# Altium project Smart_Door.PrjPcb (part 2 of 2)

## Sheet [06]-POWER_SUPPLY.SchDoc
size A4; Organization: Indruino Co., Ltd; Address1: No. 1, Vo Van Ngan Street; Address2: Thu Duc District, HCMC; SheetNumber: 7; SheetTotal: 9
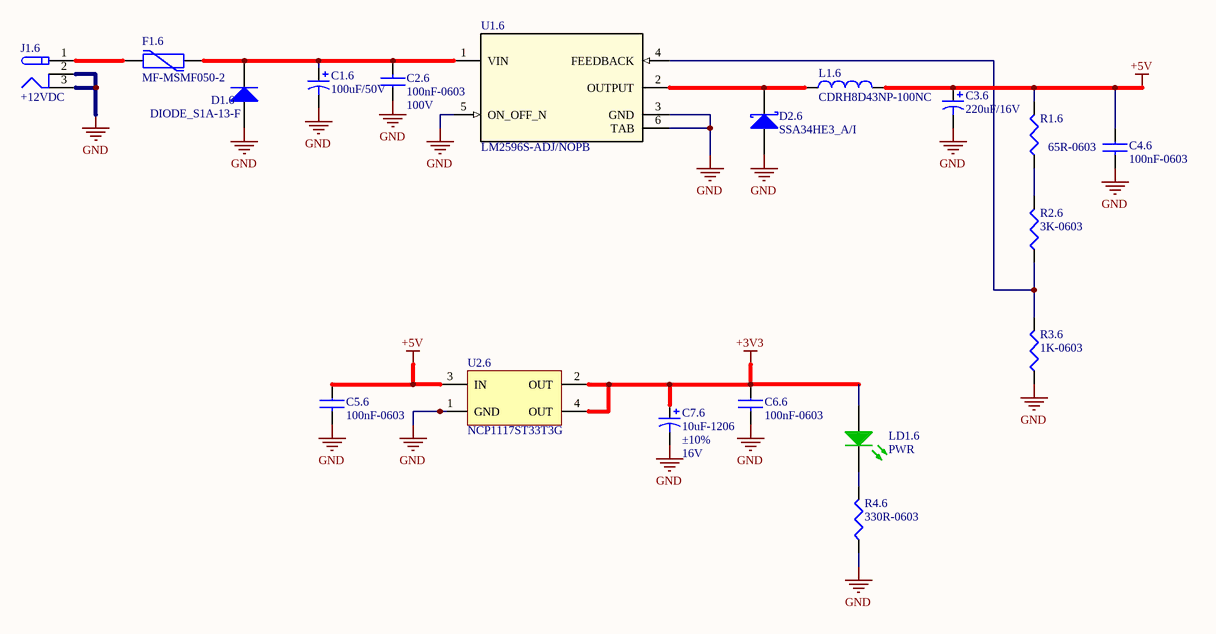
[diagram p4: [06]-POWER_SUPPLY.SchDoc]

### Parts
C1.6  value 100uF/50V  [CAPPR5-10x16]  (hidden comment: Cap Polar)
C2.6  100nF-0603  Voltage - Rated: 100V  [CAP0603]
C3.6  value 220uF/16V  [CAPPR5-10x16]  (hidden comment: Cap Polar)
C4.6  100nF-0603  [CAP0603]
C5.6  100nF-0603  [CAP0603]
C6.6  100nF-0603  [CAP0603]
C7.6  10uF-1206  Tolerance: ±10%  Voltage - Rated: 16V  [CAP1206_TANTALUM_YELLOW]
D1.6  DIODE_S1A-13-F  [DO-214AC]
D2.6  SSA34HE3_A/I  [DO-214AC]
F1.6  MF-MSMF050-2  [FUSE_PTC_SMD1812_02]
J1.6  +12VDC  [DCIN_5.5/2.1]
L1.6  CDRH8D43NP-100NC  [INDC_CDRH8D43]
LD1.6  PWR  [LED_SMD0603_GREEN]
R1.6  65R-0603  [RES0603]
R2.6  3K-0603  [RES0603]
R3.6  1K-0603  [RES0603]
R4.6  330R-0603  [RES0603]
U1.6  LM2596S-ADJ/NOPB  [TO-263-5]
U2.6  NCP1117ST33T3G  [SOT223-4M_AMS1117_3V3]

### Nets
+3V3: C6.6.1 C7.6.1 LD1.6.1(A) U2.6.2(OUT) U2.6.4(OUT)
+5V: C3.6.1 C4.6.1 C5.6.1 L1.6.2 R1.6.2 U2.6.3(IN)
GND: C1.6.2 C2.6.1 C3.6.2 C4.6.2 C5.6.2 C6.6.2 C7.6.2 D1.6.1(A) D2.6.1(A) J1.6.2(NC) J1.6.3(-) R3.6.1 R4.6.1 U1.6.3(GND) U1.6.5(ON_OFF_N) U1.6.6(TAB) U2.6.1(GND)
NetC1.6_1: C1.6.1 C2.6.2 D1.6.2(K) F1.6.2 U1.6.1(VIN)
NetD2.6_2: D2.6.2(K) L1.6.1 U1.6.2(OUTPUT)
NetF1.6_1: F1.6.1 J1.6.1(+)
NetLD1.6_2: LD1.6.2(K) R4.6.2
NetR1.6_1: R1.6.1 R2.6.2
NetR2.6_1: R2.6.1 R3.6.2 U1.6.4(FEEDBACK)

### Notes on the sheet
- Title
- Size:
- Date:
- Author:
- A4
- Time:
- Number:
- Checked:
- Revision:
- Sheet
- Approved:
- of
- File:

### Library data of the parts
C1.6 C3.6 = Cap Polar: Polarized Capacitor; Published: 8-Jun-2000; LatestRevisionDate: 17-Jul-2002; LatestRevisionNote: Re-released for DXP Platform.; PackageReference: POLAR0.8; Publisher: Altium Limited
C2.6 = CC0603KRX7R0BB104: CAP CER 0.1UF 100V X7R 0603; Manufacturer: Yageo; Tolerance: ±10%; Value: 100nF; Supplier 1: Digi-Key; Manufacturer Part Number: CC0603KRX7R0BB104; RoHS: RoHS Compliant; Category: Capacitors; Stock 1: 784508; Pricing 1: 1=0.23, 10=0.156, 100=0.0791, 500=0.05414, 1000=0.0479 (USD); Packaging: Cut Tape (CT); Part Status: Active; Temperature Coefficient: X7R; Operating Temperature: -55°C ~ 125°C; Features: -; Ratings: -; Applications: General Purpose; Failure Rate: -; Mounting Type: Surface Mount, MLCC; Package / Case: 0603 (1608 Metric); Size / Dimension: 0.063" L x 0.032" W (1.60mm x 0.80mm); Height - Seated (Max): -; Thickness (Max): 0.035" (0.90mm); Lead Spacing: -; Lead Style: -; ComponentLink1URL: http://media.digikey.com/pdf/Data%20Sheets/Yageo%20PDFs/NPO,%20X7R%20Mid-voltage.pdf; ComponentLink1Description: http://media.digikey.com/pdf/Data%20Sheets/Yageo%20PDFs/NPO,%20X7R%20Mid-voltage.pdf; Supplier Part Number 1: 311-1523-1-ND
C4.6 C5.6 C6.6 = CC0603KRX7R9BB104: CAP CER 0.1UF 50V X7R 0603; Manufacturer 1: Yageo; Category 1: Capacitors; Capacitance: 0.1µF; Tolerance: ±10%; Value: 100nF; Supplier 1: Digi-Key; Supplier Part Number 1: 311-1344-1-ND; Manufacturer Part Number 1: CC0603KRX7R9BB104; RoHS 1: RoHS Compliant; Description 1: CAP CER 0.1UF 50V X7R 0603; Stock 1: 4411645; Pricing 1: 1=0.1, 10=0.031, 100=0.014, 500=0.00998, 1000=0.00783 (USD); Packaging: Cut Tape (CT); Part Status: Active; Voltage - Rated: 50V; Temperature Coefficient: X7R; Operating Temperature: -55°C ~ 125°C; Features: -; Ratings: -; Applications: General Purpose; Failure Rate: -; Mounting Type: Surface Mount, MLCC; Package / Case: 0603 (1608 Metric); Size / Dimension: 0.063" L x 0.031" W (1.60mm x 0.80mm); Height - Seated (Max): -; Thickness (Max): 0.035" (0.90mm); Lead Spacing: -; Lead Style: -; ComponentLink1URL: http://www.yageo.com/documents/recent/UPY-GPHC_X7R_6.3V-to-50V_18.pdf; ComponentLink1Description: http://www.yageo.com/documents/recent/UPY-GPHC_X7R_6.3V-to-50V_18.pdf
C7.6 = T491A106K016AT: CAP TANT 10UF 16V 10% 1206; Manufacturer 1: KEMET; Manufacturer Size Code: A; Category 1: Capacitors; Capacitance: 10µF; Type: Molded; ESR (Equivalent Series Resistance): 7 Ohm; Lifetime @ Temp.: 2000 Hrs @ 85°C; Supplier 1: Digi-Key; Supplier Part Number 1: 399-8269-1-ND; Manufacturer Part Number 1: T491A106K016AT; RoHS 1: RoHS Compliant; Description 1: CAP TANT 10UF 16V 10% 1206; Stock 1: 54083; Pricing 1: 1=0.45, 10=0.312, 100=0.1873, 500=0.14048, 1000=0.11862 (USD); Packaging: Cut Tape (CT); Part Status: Active; Operating Temperature: -55°C ~ 125°C; Mounting Type: Surface Mount; Package / Case: 1206 (3216 Metric); Size / Dimension: 0.126" L x 0.063" W (3.20mm x 1.60mm); Height - Seated (Max): 0.071" (1.80mm); Lead Spacing: -; Features: General Purpose; Failure Rate: -; ComponentLink1URL: http://www.kemet.com/Lists/ProductCatalog/Attachments/254/KEM_T2005_T491.pdf; ComponentLink1Description: http://www.kemet.com/Lists/ProductCatalog/Attachments/254/KEM_T2005_T491.pdf; Value: 10uF
D1.6 = DIODE_S1A-13-F: DIODE GEN PURP 50V 1A SMA; Manufacturer: Diodes Incorporated; Diode Type: Standard; Speed: Standard Recovery >500ns, > 200mA (Io); Capacitance @ Vr, F: 10pF @ 4V, 1MHz; Supplier 1: Digi-Key; Manufacturer Part Number: S1A-13-F; RoHS: RoHS Compliant; Category: Discrete Semiconductor Products; Stock 1: 293435; Pricing 1: 1=0.27, 10=0.219, 100=0.1163, 500=0.07652, 1000=0.05203 (USD); Packaging: Digi-Reel®; Part Status: Active; Current - Average Rectified (Io): 1A; Mounting Type: Surface Mount; Package / Case: DO-214AC, SMA; Supplier Device Package: SMA; Operating Temperature - Junction: -65°C ~ 150°C; Base Part Number: S1A; ComponentLink1URL: https://www.diodes.com/assets/Datasheets/ds16003.pdf; ComponentLink1Description: https://www.diodes.com/assets/Datasheets/ds16003.pdf; Supplier Part Number 1: S1A-FDIDKR-ND
D2.6 = DIODE_SSA34HE3_A/I: DIODE SCHOTTKY 40V 3A DO214AC; Manufacturer 1: Vishay Semiconductor Diodes Division; Category 1: Discrete Semiconductor Products; Voltage - Forward (Vf) (Max) @ If: 490mV @ 3A; Speed: Fast Recovery =< 500ns, > 200mA (Io); Current - Reverse Leakage @ Vr: 200µA @ 40V; Supplier 1: Digi-Key; Supplier Part Number 1: SSA34HE3_A/I-ND; Manufacturer Part Number 1: SSA34HE3_A/I; RoHS 1: RoHS Compliant; Description 1: DIODE SCHOTTKY 40V 3A DO214AC; Stock 1: 0; Pricing 1: 7500=0.13508 (USD); Packaging: Tape & Reel (TR); Part Status: Active; Diode Type: Schottky; Voltage - DC Reverse (Vr) (Max): 40V; Current - Average Rectified (Io): 3A; Capacitance @ Vr, F: -; Mounting Type: Surface Mount; Package / Case: DO-214AC, SMA; Supplier Device Package: DO-214AC (SMA); Operating Temperature - Junction: -65°C ~ 150°C; ComponentLink1URL: http://www.vishay.com/docs/88883/ssa33l.pdf; ComponentLink1Description: http://www.vishay.com/docs/88883/ssa33l.pdf
F1.6 = FUSE_MF-MSMF050-2: Resettable Fuses - PPTC 0.50A 15V 0.15ohm AE C-Q200; Manufacturer: Bourns; Resistance: 150 mOhms; Type: PTC Resettable Fuses; Current Rating - Max: 100 A; Hold Current: 500 mA; Trip Current: 1 A; Pd - Power Dissipation: 800 mW; Supplier 1: Mouser; Manufacturer Part Number: MF-MSMF050-2; RoHS: RoHS Compliant; Category: Resettable Fuses - PPTC; Stock 1: 36274; Pricing 1: 1=0.310, 10=0.262, 100=0.244, 250=0.217, 500=0.181, 1000=0.172, 2500=0.166, 4000=0.155, 8000=0.129 (USD); Height: 0.85 mm; Length: 4.73 mm; Package / Case: 1812 (4532 metric); Packaging: Cut Tape; Series: MF-MSMF; Termination Style: SMD/SMT; Width: 3.41 mm; Brand: Bourns; Maximum Voltage: 15 V; Mounting Style: SMD/SMT; Maximum Operating Temperature: + 85 C; Minimum Operating Temperature: - 40 C; Product Type: Resettable Fuses - PPTC; Qualification: AEC-Q200; Standard Pack Qty: 4000; Subcategory: PPTC Resettable Fuses; Tradename: Multifuse; RoHS - Mouser: Y; Minimum Order Quantity: 1; Reeling: True; ComponentLink1URL: https://www.mouser.com/datasheet/2/54/mfmsmf-772347.pdf; ComponentLink1Description: https://www.mouser.com/datasheet/2/54/mfmsmf-772347.pdf; Supplier Part Number 1: 652-MF-MSMF050-2
J1.6 = DCIN_5.5/2.1
L1.6 = IND_CDRH8D43NP-100NC: FIXED IND 10UH 3.2A 36 MOHM SMD; Manufacturer: Sumida America Components Inc.; Material - Core: Ferrite; Tolerance: ±30%; Shielding: Shielded; DC Resistance (DCR): 36 mOhm Max; Supplier 1: Digi-Key; Manufacturer Part Number: CDRH8D43NP-100NC; RoHS: RoHS Compliant; Category: Inductors, Coils, Chokes; Stock 1: 2346; Pricing 1: 1=1.21, 10=1.121, 100=0.8108 (USD); Packaging: Cut Tape (CT); Part Status: Active; Type: -; Q @ Freq: -; Ratings: -; Operating Temperature: -40°C ~ 100°C; Mounting Type: Surface Mount; Package / Case: Nonstandard; Supplier Device Package: -; Size / Dimension: 0.315" L x 0.315" W (8.00mm x 8.00mm); Height - Seated (Max): 0.177" (4.50mm); ComponentLink1URL: http://products.sumida.com/products/pdf/CDRH8D43.pdf; ComponentLink1Description: http://products.sumida.com/products/pdf/CDRH8D43.pdf; Supplier Part Number 1: 308-1665-1-ND
LD1.6 = LED_LTST-C191KGKT: LED GREEN CLEAR 0603 SMD; Manufacturer 1: Lite-On Inc.; Category 1: Optoelectronics; Lens Color: Colorless; Millicandela Rating: 35mcd; Lens Style/Size: Rectangle with Flat Top, 1.10mm x 0.80mm; Voltage - Forward (Vf) (Typ): 2V; Current - Test: 20mA; Viewing Angle: 130°; Wavelength - Dominant: 571nm; Wavelength - Peak: 574nm; Supplier 1: Digi-Key; Supplier Part Number 1: 160-1446-1-ND; Manufacturer Part Number 1: LTST-C191KGKT; RoHS 1: RoHS Compliant; Description 1: LED GREEN CLEAR 0603 SMD; Stock 1: 1325167; Pricing 1: 1=0.29, 10=0.211, 25=0.1556, 100=0.1111, 250=0.07556, 500=0.06666, 1000=0.05222, 2500=0.05111 (USD); Packaging: Cut Tape (CT); Part Status: Active; Color: Green; Lens Transparency: Clear; Mounting Type: Surface Mount; Features: -; Size / Dimension: 1.60mm L x 0.80mm W; Height (Max): 0.55mm; ComponentLink1URL: http://optoelectronics.liteon.com/upload/download/DS22-2000-228/S_110_LTST-C191KGKT.pdf; ComponentLink1Description: http://optoelectronics.liteon.com/upload/download/DS22-2000-228/S_110_LTST-C191KGKT.pdf; Package / Case: 0603 (1608 Metric)
R1.6 = RC0603JR-0722RL: RES SMD 22 OHM 5% 1/10W 0603; Manufacturer 1: Yageo; Category 1: Resistors; Resistance (Ohms): 22; Power (Watts): 0.1W, 1/10W; Temperature Coefficient: ±100ppm/°C; Value: 22R; Supplier 1: Digi-Key; Supplier Part Number 1: 311-22GRCT-ND; Manufacturer Part Number 1: RC0603JR-0722RL; RoHS 1: RoHS Compliant; Description 1: RES SMD 22 OHM 5% 1/10W 0603; Stock 1: 344316; Pricing 1: 1=0.1, 10=0.011, 100=0.0044, 1000=0.00198, 2500=0.00172 (USD); Packaging: Cut Tape (CT); Part Status: Active; Composition: Thick Film; Features: Moisture Resistant; Operating Temperature: -55°C ~ 155°C; Package / Case: 0603 (1608 Metric); Size / Dimension: 0.063" L x 0.031" W (1.60mm x 0.80mm); Height - Seated (Max): 0.022" (0.55mm); Failure Rate: -; ComponentLink1URL: http://www.yageo.com/documents/recent/PYu-RC_Group_51_RoHS_L_7.pdf; ComponentLink1Description: http://www.yageo.com/documents/recent/PYu-RC_Group_51_RoHS_L_7.pdf; Tolerance: ±5%; Supplier Device Package: 0603
R2.6 = RC0603JR-073K3L: Thick Film Resistors - SMD 3.3K OHM 5%; Manufacturer: Yageo; Power Rating: 100 mW (1/10 W); Resistance: 3.3 kOhms; Temperature Coefficient: 100 PPM / C; Voltage Rating: 75 V; Value: 3K3; Supplier 1: Mouser; Manufacturer Part Number: RC0603JR-073K3L; RoHS: RoHS Compliant By Exemption; Category: Thick Film Resistors - SMD; Stock 1: 313041; Pricing 1: 1=0.100, 10=0.015, 100=0.005, 1000=0.004, 5000=0.004 (USD); Application: High Reliability; Features: -; Height: 0.45 mm; Length: 1.6 mm; Package / Case: -; Packaging: Cut Tape; Product: Thick Film Resistors SMD; Series: RC; Technology: Thick Film; Termination Style: SMD/SMT; Tolerance: 5 %; Type: General Purpose; Width: 0.8 mm; Brand: Yageo; Mounting Style: PCB Mount; Case Code - in: 0603; Case Code - mm: 1608; Maximum Operating Temperature: + 155 C; Minimum Operating Temperature: - 55 C; Product Type: Thick Film Resistors; Standard Pack Qty: 5000; Subcategory: Resistors; RoHS - Mouser: E; Minimum Order Quantity: 1; Reeling: True; ComponentLink1URL: https://www.mouser.com/datasheet/2/447/PYu-RC_Group_51_RoHS_L_10-1664068.pdf; ComponentLink1Description: https://www.mouser.com/datasheet/2/447/PYu-RC_Group_51_RoHS_L_10-1664068.pdf; Supplier Part Number 1: 603-RC0603JR-073K3L
R3.6 = RC0603JR-071KL: RES SMD 1K OHM 5% 1/10W 0603; Manufacturer 1: Yageo; Category 1: Resistors; Power (Watts): 0.1W, 1/10W; Temperature Coefficient: ±100ppm/°C; Supplier 1: Digi-Key; Supplier Part Number 1: 311-1.0KGRCT-ND; Manufacturer Part Number 1: RC0603JR-071KL; RoHS 1: RoHS Compliant; Description 1: RES SMD 1K OHM 5% 1/10W 0603; Stock 1: 2853955; Pricing 1: 1=0.1, 10=0.011, 100=0.0044, 1000=0.00198, 2500=0.00172 (USD); Packaging: Cut Tape (CT); Part Status: Active; Resistance (Ohms): 1k; Tolerance: ±5%; Composition: Thick Film; Features: Moisture Resistant; Operating Temperature: -55°C ~ 155°C; Package / Case: 0603 (1608 Metric); Supplier Device Package: 0603; Size / Dimension: 0.063" L x 0.031" W (1.60mm x 0.80mm); Height - Seated (Max): 0.022" (0.55mm); Failure Rate: -; ComponentLink1URL: http://www.yageo.com/documents/recent/PYu-RC_Group_51_RoHS_L_7.pdf; ComponentLink1Description: http://www.yageo.com/documents/recent/PYu-RC_Group_51_RoHS_L_7.pdf; Value: 1K
R4.6 = RC0603JR-07330RL: RES SMD 330 OHM 5% 1/10W 0603; Manufacturer 1: Yageo; Category 1: Resistors; Resistance (Ohms): 330; Power (Watts): 0.1W, 1/10W; Temperature Coefficient: ±100ppm/°C; Value: 330R; Supplier 1: Digi-Key; Supplier Part Number 1: 311-330GRCT-ND; Manufacturer Part Number 1: RC0603JR-07330RL; RoHS 1: RoHS Compliant; Description 1: RES SMD 330 OHM 5% 1/10W 0603; Stock 1: 1463213; Pricing 1: 1=0.1, 10=0.011, 100=0.0046, 1000=0.00207, 2500=0.0018 (USD); Packaging: Cut Tape (CT); Part Status: Active; Tolerance: ±5%; Composition: Thick Film; Features: Moisture Resistant; Operating Temperature: -55°C ~ 155°C; Package / Case: 0603 (1608 Metric); Supplier Device Package: 0603; Size / Dimension: 0.063" L x 0.031" W (1.60mm x 0.80mm); Height - Seated (Max): 0.022" (0.55mm); Failure Rate: -; ComponentLink1URL: http://www.yageo.com/documents/recent/PYu-RC_Group_51_RoHS_L_7.pdf; ComponentLink1Description: http://www.yageo.com/documents/recent/PYu-RC_Group_51_RoHS_L_7.pdf
U1.6 = LM2596S-ADJ/NOPB: No Description Available; Mfr_Name: Texas Instruments; PartNumber: LM2596SX-ADJ/NOPB; CompType: IC; Type: DEV; RefDes: RefDes; Copyright: Copyright (C) 2021 Ultra Librarian. All rights reserved.; Manufacturer_Part_Number: LM2596S-ADJ/NOPB; Alternate_PartNumber: LM2596S-ADJ/NOPB; PackageReference: KTT0005B; MountType: SMT; RoHS: Y; Manufacturer: Texas Instruments
U2.6 = NCP1117ST33T3G: LDO Voltage Regulators 3.3V 1A Positive; Manufacturer: ON Semiconductor; Input Voltage MAX: 20 V; Number of Outputs: 1 Output; Output Type: Fixed; Quiescent Current: 10 mA; Dropout Voltage - Max: 1.1 V at 100 mA; Voltage Regulation Accuracy: 1 %; Dropout Voltage: 0.95 V at 100 mA; Ib - Input Bias Current: 6 mA; Line Regulation: 0.8 mV; Load Regulation: 4.3 mV; Supplier 1: Mouser; Manufacturer Part Number: NCP1117ST33T3G; RoHS: RoHS Compliant; Category: LDO Voltage Regulators; Stock 1: 0; Pricing 1: 1=0.450, 10=0.366, 100=0.223, 1000=0.173, 4000=0.147, 8000=0.137, 24000=0.130, 48000=0.127 (USD); Height: 1.69 mm (Max); Length: 6.7 mm (Max); Output Current: 1 A; Output Voltage: 3.3 V; Package / Case: SOT-223-3; Packaging: Cut Tape; Series: NCP1117; Width: 3.7 mm (Max); Brand: ON Semiconductor; Mounting Style: SMD/SMT; Maximum Operating Temperature: + 125 C; Minimum Operating Temperature: 0 C; Polarity: Positive; Standard Pack Qty: 4000; RoHS - Mouser: Y; Minimum Order Quantity: 1; Reeling: True; ComponentLink1URL: https://www.mouser.com/ds/2/308/NCP1117-D-81326.pdf; ComponentLink1Description: https://www.mouser.com/ds/2/308/NCP1117-D-81326.pdf; Supplier Part Number 1: 863-NCP1117ST33T3G

## Sheet [07]-SOLENOID.SchDoc
size A4; Organization: Indruino Co., Ltd; Address1: No. 1, Vo Van Ngan Street; Address2: Thu Duc District, HCMC; SheetNumber: 8; SheetTotal: 9
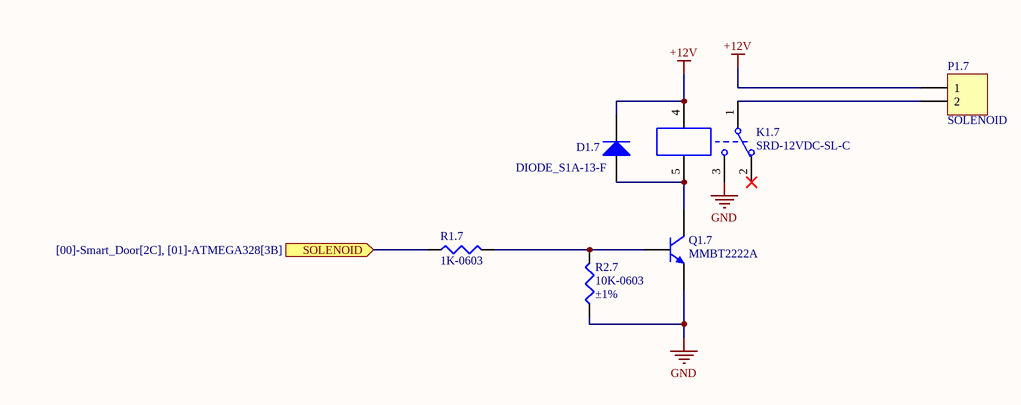
[diagram p5: [07]-SOLENOID.SchDoc]

### Parts
D1.7  DIODE_S1A-13-F  [DO-214AC]
K1.7  SRD-12VDC-SL-C  [RELAY5PIN-10A]
P1.7  SOLENOID  [DOMINO_2PIN_3.81MM_RUT]
Q1.7  MMBT2222A  [SOT23-3]
R1.7  1K-0603  [RES0603]
R2.7  10K-0603  Tolerance: ±1%  [RES0603]

### Ports
SOLENOID (in, see [00]-Smart_Door[2C], [01]-ATMEGA328[3B])

### Nets
+12V: D1.7.2(K) K1.7.4 P1.7.1
GND: K1.7.3(NO) Q1.7.2(E) R2.7.1
SOLENOID: R1.7.1 ; port SOLENOID
NetD1.7_1: D1.7.1(A) K1.7.5 Q1.7.3(C)
NetK1.7_1: K1.7.1(COM) P1.7.2
NetQ1.7_1: Q1.7.1(B) R1.7.2 R2.7.2

Not connected (* = marked no-connect by the designer): K1.7 2(NC)*

### Notes on the sheet
- Title
- Size:
- Date:
- Author:
- A4
- Time:
- Number:
- Checked:
- Revision:
- Sheet
- Approved:
- of
- File:

### Library data of the parts
D1.7 = DIODE_S1A-13-F: as D1.6 on sheet [06]-POWER_SUPPLY; Supplier 1: Digi-Key; Manufacturer Part Number: S1A-13-F; RoHS: RoHS Compliant; Category: Discrete Semiconductor Products; Stock 1: 293435; Pricing 1: 1=0.27, 10=0.219, 100=0.1163, 500=0.07652, 1000=0.05203 (USD); Packaging: Digi-Reel®; Part Status: Active; Current - Average Rectified (Io): 1A; Mounting Type: Surface Mount; Package / Case: DO-214AC, SMA; Supplier Device Package: SMA; Operating Temperature - Junction: -65°C ~ 150°C; Base Part Number: S1A; ComponentLink1URL: https://www.diodes.com/assets/Datasheets/ds16003.pdf; ComponentLink1Description: https://www.diodes.com/assets/Datasheets/ds16003.pdf; Supplier Part Number 1: S1A-FDIDKR-ND
K1.7 = Relay-SRD-05VDC-SL-C: Published: 24-Mar-1999; LatestRevisionDate: 17-Jul-2002; LatestRevisionNote: Re-released for DXP Platform.; PackageReference: DIP-P8; Publisher: Altium Limited
P1.7 = Domino 2 pin
Q1.7 = MMBT2222A: TRANS NPN 40V 1A SOT-23; Manufacturer: ON Semiconductor; Vce Saturation (Max) @ Ib, Ic: 1V @ 50mA, 500mA; Current - Collector Cutoff (Max): 10nA (ICBO); DC Current Gain (hFE) (Min) @ Ic, Vce: 100 @ 150mA, 10V; Frequency - Transition: 300MHz; Supplier 1: Digi-Key; Manufacturer Part Number: MMBT2222A; RoHS: RoHS Compliant; Category: Discrete Semiconductor Products; Stock 1: 220769; Pricing 1: 1=0.21, 10=0.17, 100=0.09, 500=0.05922, 1000=0.04027 (USD); Packaging: Cut Tape (CT); Part Status: Last Time Buy; Transistor Type: NPN; Operating Temperature: 150°C (TJ); Mounting Type: Surface Mount; Package / Case: TO-236-3, SC-59, SOT-23-3; Supplier Device Package: SOT-23-3; Base Part Number: MMBT2222; ComponentLink1URL: https://www.fairchildsemi.com/datasheets/MM/MMBT2222A.pdf; ComponentLink1Description: https://www.fairchildsemi.com/datasheets/MM/MMBT2222A.pdf; Supplier Part Number 1: MMBT2222AFSCT-ND
R1.7 = RC0603JR-071KL: as R3.6 on sheet [06]-POWER_SUPPLY; Supplier 1: Digi-Key; Supplier Part Number 1: 311-1.0KGRCT-ND; Manufacturer Part Number 1: RC0603JR-071KL; RoHS 1: RoHS Compliant; Description 1: RES SMD 1K OHM 5% 1/10W 0603; Stock 1: 2853955; Pricing 1: 1=0.1, 10=0.011, 100=0.0044, 1000=0.00198, 2500=0.00172 (USD); Packaging: Cut Tape (CT); Part Status: Active; Resistance (Ohms): 1k; Tolerance: ±5%; Composition: Thick Film; Features: Moisture Resistant; Operating Temperature: -55°C ~ 155°C; Package / Case: 0603 (1608 Metric); Supplier Device Package: 0603; Size / Dimension: 0.063" L x 0.031" W (1.60mm x 0.80mm); Height - Seated (Max): 0.022" (0.55mm); Failure Rate: -; ComponentLink1URL: http://www.yageo.com/documents/recent/PYu-RC_Group_51_RoHS_L_7.pdf; ComponentLink1Description: http://www.yageo.com/documents/recent/PYu-RC_Group_51_RoHS_L_7.pdf; Value: 1K
R2.7 = RC0603FR-0710KL: RES SMD 10K OHM 1% 1/10W 0603; Manufacturer: Yageo; Power (Watts): 0.1W, 1/10W; Temperature Coefficient: ±100ppm/°C; Supplier 1: Digi-Key; Manufacturer Part Number: RC0603FR-0710KL; RoHS: RoHS Compliant; Category: Resistors; Stock 1: 16545228; Pricing 1: 1=0.1, 10=0.015, 100=0.006, 1000=0.00268, 2500=0.00233 (USD); Packaging: Cut Tape (CT); Part Status: Active; Composition: Thick Film; Features: Moisture Resistant; Operating Temperature: -55°C ~ 155°C; Package / Case: 0603 (1608 Metric); Supplier Device Package: 0603; Size / Dimension: 0.063" L x 0.032" W (1.60mm x 0.80mm); Height - Seated (Max): 0.022" (0.55mm); Failure Rate: -; ComponentLink1URL: http://www.yageo.com/documents/recent/PYu-RC_Group_51_RoHS_L_7.pdf; ComponentLink1Description: http://www.yageo.com/documents/recent/PYu-RC_Group_51_RoHS_L_7.pdf; Supplier Part Number 1: 311-10.0KHRCT-ND; Value: 10K

## Sheet [08]-ALARM.SchDoc
size A4; Organization: Indruino Co., Ltd; Address1: No. 1, Vo Van Ngan Street; Address2: Thu Duc District, HCMC; SheetNumber: 9; SheetTotal: 9
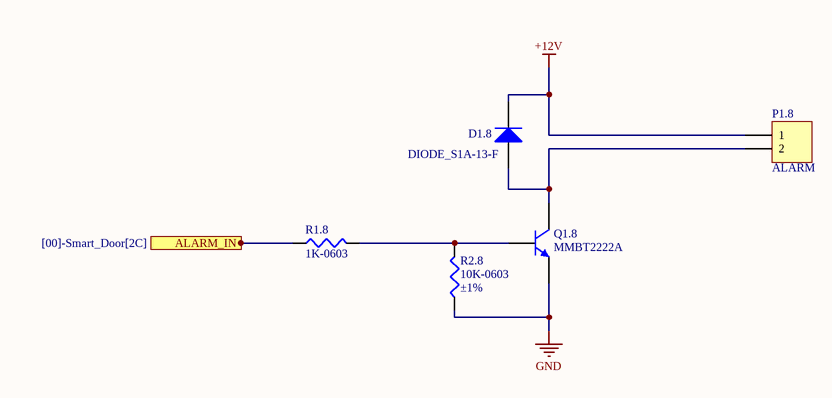
[diagram p6: [08]-ALARM.SchDoc]

### Parts
D1.8  DIODE_S1A-13-F  [DO-214AC]
P1.8  ALARM  [DOMINO_2PIN_3.81MM_RUT]
Q1.8  MMBT2222A  [SOT23-3]
R1.8  1K-0603  [RES0603]
R2.8  10K-0603  Tolerance: ±1%  [RES0603]

### Ports
ALARM_IN (in, see [00]-Smart_Door[2C])

### Nets
+12V: D1.8.2(K) P1.8.1
GND: Q1.8.2(E) R2.8.1
ALARM: R1.8.1 ; port ALARM_IN
NetD1.8_1: D1.8.1(A) P1.8.2 Q1.8.3(C)
NetQ1.8_1: Q1.8.1(B) R1.8.2 R2.8.2

### Notes on the sheet
- Title
- Size:
- Date:
- Author:
- A4
- Time:
- Number:
- Checked:
- Revision:
- Sheet
- Approved:
- of
- File:

### Library data of the parts
D1.8 = DIODE_S1A-13-F: as D1.6 on sheet [06]-POWER_SUPPLY; Supplier 1: Digi-Key; Manufacturer Part Number: S1A-13-F; RoHS: RoHS Compliant; Category: Discrete Semiconductor Products; Stock 1: 293435; Pricing 1: 1=0.27, 10=0.219, 100=0.1163, 500=0.07652, 1000=0.05203 (USD); Packaging: Digi-Reel®; Part Status: Active; Current - Average Rectified (Io): 1A; Mounting Type: Surface Mount; Package / Case: DO-214AC, SMA; Supplier Device Package: SMA; Operating Temperature - Junction: -65°C ~ 150°C; Base Part Number: S1A; ComponentLink1URL: https://www.diodes.com/assets/Datasheets/ds16003.pdf; ComponentLink1Description: https://www.diodes.com/assets/Datasheets/ds16003.pdf; Supplier Part Number 1: S1A-FDIDKR-ND
P1.8 = Domino 2 pin
Q1.8 = MMBT2222A: as Q1.7 on sheet [07]-SOLENOID; Supplier 1: Digi-Key; Manufacturer Part Number: MMBT2222A; RoHS: RoHS Compliant; Category: Discrete Semiconductor Products; Stock 1: 220769; Pricing 1: 1=0.21, 10=0.17, 100=0.09, 500=0.05922, 1000=0.04027 (USD); Packaging: Cut Tape (CT); Part Status: Last Time Buy; Transistor Type: NPN; Operating Temperature: 150°C (TJ); Mounting Type: Surface Mount; Package / Case: TO-236-3, SC-59, SOT-23-3; Supplier Device Package: SOT-23-3; Base Part Number: MMBT2222; ComponentLink1URL: https://www.fairchildsemi.com/datasheets/MM/MMBT2222A.pdf; ComponentLink1Description: https://www.fairchildsemi.com/datasheets/MM/MMBT2222A.pdf; Supplier Part Number 1: MMBT2222AFSCT-ND
R1.8 = RC0603JR-071KL: as R3.6 on sheet [06]-POWER_SUPPLY; Supplier 1: Digi-Key; Supplier Part Number 1: 311-1.0KGRCT-ND; Manufacturer Part Number 1: RC0603JR-071KL; RoHS 1: RoHS Compliant; Description 1: RES SMD 1K OHM 5% 1/10W 0603; Stock 1: 2853955; Pricing 1: 1=0.1, 10=0.011, 100=0.0044, 1000=0.00198, 2500=0.00172 (USD); Packaging: Cut Tape (CT); Part Status: Active; Resistance (Ohms): 1k; Tolerance: ±5%; Composition: Thick Film; Features: Moisture Resistant; Operating Temperature: -55°C ~ 155°C; Package / Case: 0603 (1608 Metric); Supplier Device Package: 0603; Size / Dimension: 0.063" L x 0.031" W (1.60mm x 0.80mm); Height - Seated (Max): 0.022" (0.55mm); Failure Rate: -; ComponentLink1URL: http://www.yageo.com/documents/recent/PYu-RC_Group_51_RoHS_L_7.pdf; ComponentLink1Description: http://www.yageo.com/documents/recent/PYu-RC_Group_51_RoHS_L_7.pdf; Value: 1K
R2.8 = RC0603FR-0710KL: as R2.7 on sheet [07]-SOLENOID; Supplier 1: Digi-Key; Manufacturer Part Number: RC0603FR-0710KL; RoHS: RoHS Compliant; Category: Resistors; Stock 1: 16545228; Pricing 1: 1=0.1, 10=0.015, 100=0.006, 1000=0.00268, 2500=0.00233 (USD); Packaging: Cut Tape (CT); Part Status: Active; Composition: Thick Film; Features: Moisture Resistant; Operating Temperature: -55°C ~ 155°C; Package / Case: 0603 (1608 Metric); Supplier Device Package: 0603; Size / Dimension: 0.063" L x 0.032" W (1.60mm x 0.80mm); Height - Seated (Max): 0.022" (0.55mm); Failure Rate: -; ComponentLink1URL: http://www.yageo.com/documents/recent/PYu-RC_Group_51_RoHS_L_7.pdf; ComponentLink1Description: http://www.yageo.com/documents/recent/PYu-RC_Group_51_RoHS_L_7.pdf; Supplier Part Number 1: 311-10.0KHRCT-ND; Value: 10K

## Sheet [03]-MPU6050.SchDoc
size A4; Organization: Indruino Co., Ltd; Address1: No. 1, Vo Van Ngan Street; Address2: Thu Duc District, HCMC; SheetNumber: 4; SheetTotal: 9
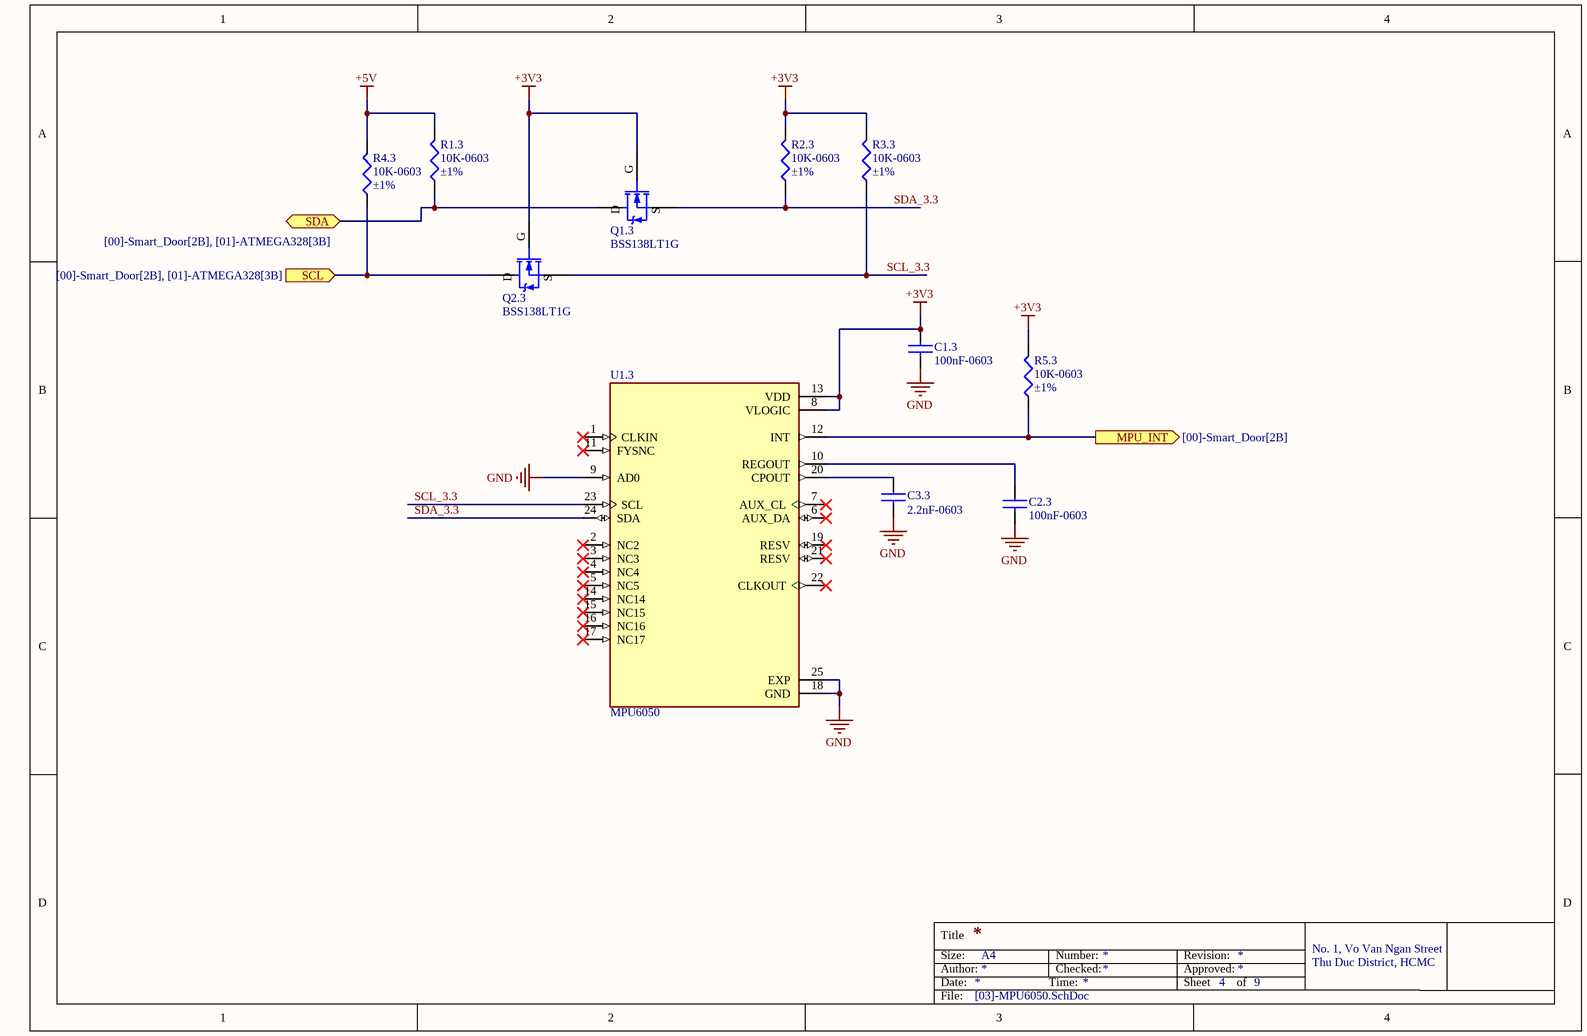
[diagram p7: [03]-MPU6050.SchDoc]

### Parts
C1.3  100nF-0603  [CAP0603]
C2.3  100nF-0603  [CAP0603]
C3.3  2.2nF-0603  [CAP0603]
Q1.3  BSS138LT1G  [SOT23]
Q2.3  BSS138LT1G  [SOT23]
R1.3  10K-0603  Tolerance: ±1%  [RES0603]
R2.3  10K-0603  Tolerance: ±1%  [RES0603]
R3.3  10K-0603  Tolerance: ±1%  [RES0603]
R4.3  10K-0603  Tolerance: ±1%  [RES0603]
R5.3  10K-0603  Tolerance: ±1%  [RES0603]
U1.3  MPU6050  [IC_MPU6050]

### Ports
MPU_INT (out, see [00]-Smart_Door[2B]), SCL (in, see [00]-Smart_Door[2B], [01]-ATMEGA328[3B]), SDA (bidir, see [00]-Smart_Door[2B], [01]-ATMEGA328[3B])

### Nets
+3V3: C1.3.1 Q1.3.1(G) Q2.3.1(G) R2.3.2 R3.3.2 R5.3.2 U1.3.8(VLOGIC) U1.3.13(VDD)
+5V: R1.3.2 R4.3.2
GND: C1.3.2 C2.3.2 C3.3.2 U1.3.9(AD0) U1.3.18(GND) U1.3.25(EXP)
MPU6050_INT: R5.3.1 U1.3.12(INT) ; port MPU_INT
SCL: Q2.3.3(D) R4.3.1 ; port SCL
SCL_3.3: Q2.3.2(S) R3.3.1 U1.3.23(SCL)
SDA: Q1.3.3(D) R1.3.1 ; port SDA
SDA_3.3: Q1.3.2(S) R2.3.1 U1.3.24(SDA)
NetC2.3_1: C2.3.1 U1.3.10(REGOUT)
NetC3.3_1: C3.3.1 U1.3.20(CPOUT)

Not connected (* = marked no-connect by the designer): U1.3 1(CLKIN)* 2(NC2)* 3(NC3)* 4(NC4)* 5(NC5)* 6(AUX_DA)* 7(AUX_CL)* 11(FYSNC)* 14(NC14)* 15(NC15)* 16(NC16)* 17(NC17)* 19(RESV)* 21(RESV)* 22(CLKOUT)*

### Notes on the sheet
- Title
- Size:
- Date:
- Author:
- A4
- Time:
- Number:
- Checked:
- Revision:
- Sheet
- Approved:
- of
- File:

### Library data of the parts
C1.3 C2.3 = CC0603KRX7R9BB104: as C4.6 on sheet [06]-POWER_SUPPLY; Supplier 1: Digi-Key; Supplier Part Number 1: 311-1344-1-ND; Manufacturer Part Number 1: CC0603KRX7R9BB104; RoHS 1: RoHS Compliant; Description 1: CAP CER 0.1UF 50V X7R 0603; Stock 1: 4411645; Pricing 1: 1=0.1, 10=0.031, 100=0.014, 500=0.00998, 1000=0.00783 (USD); Packaging: Cut Tape (CT); Part Status: Active; Voltage - Rated: 50V; Temperature Coefficient: X7R; Operating Temperature: -55°C ~ 125°C; Features: -; Ratings: -; Applications: General Purpose; Failure Rate: -; Mounting Type: Surface Mount, MLCC; Package / Case: 0603 (1608 Metric); Size / Dimension: 0.063" L x 0.031" W (1.60mm x 0.80mm); Height - Seated (Max): -; Thickness (Max): 0.035" (0.90mm); Lead Spacing: -; Lead Style: -; ComponentLink1URL: http://www.yageo.com/documents/recent/UPY-GPHC_X7R_6.3V-to-50V_18.pdf; ComponentLink1Description: http://www.yageo.com/documents/recent/UPY-GPHC_X7R_6.3V-to-50V_18.pdf
C3.3 = CC0603KRX7R9BB222: Multilayer Ceramic Capacitors MLCC - SMD/SMT 2200PF 50V 10% 0603; Manufacturer: Yageo; Type: General Purpose and High Capacitance Surface Mount Ceramic Multilayer Capacitor; Voltage Rating DC: 50 VDC; Capacitance - nF: 2.2 nF; Capacitance - uF: 0.0022 uF; Class: Class 2; Dielectric: X7R; Value: 2.2nF; Supplier 1: Mouser; Manufacturer Part Number: CC0603KRX7R9BB222; RoHS: RoHS Compliant; Category: Multilayer Ceramic Capacitors MLCC - SMD/SMT; Stock 1: 167669; Pricing 1: 1=0.100, 10=0.090, 100=0.070, 1000=0.065, 4000=0.010, 8000=0.009 (USD); Capacitance: 2200 pF; Height: 0.8 mm; Length: 1.6 mm; Package / Case: 0603 (1608 metric); Packaging: Cut Tape; Product: General Type MLCCs; Series: CC; Termination Style: SMD/SMT; Tolerance: 10 %; Brand: Yageo; Case Code - in: 0603; Case Code - mm: 1608; Maximum Operating Temperature: + 125 C; Minimum Operating Temperature: - 55 C; Product Type: Ceramic Capacitors; Standard Pack Qty: 4000; Subcategory: Capacitors; Termination: Standard; RoHS - Mouser: Y; Minimum Order Quantity: 1; Reeling: True; ComponentLink1URL: https://www.mouser.com/datasheet/2/447/UPY-GPHC_X7R_6.3V-to-50V_18-1154002.pdf; ComponentLink1Description: https://www.mouser.com/datasheet/2/447/UPY-GPHC_X7R_6.3V-to-50V_18-1154002.pdf; Supplier Part Number 1: 603-C0603KRX7R9BB222; Width: 0.8 mm
Q1.3 Q2.3 = BSS138LT1G: MOSFET N-CH 50V 200MA SOT-23; Manufacturer: ON Semiconductor; FET Type: N-Channel; Current - Continuous Drain (Id) @ 25°C: 200mA (Ta); Drive Voltage (Max Rds On,  Min Rds On): 5V; Rds On (Max) @ Id, Vgs: 3.5 Ohm @ 200mA, 5V; Vgs(th) (Max) @ Id: 1.5V @ 1mA; Vgs (Max): ±20V; Power Dissipation (Max): 225mW (Ta); Supplier 1: Digi-Key; Manufacturer Part Number: BSS138LT1G; RoHS: RoHS Compliant; Category: Discrete Semiconductor Products; Stock 1: 0; Pricing 1: 1=0.31, 10=0.283, 100=0.1583, 500=0.08482, 1000=0.05768 (USD); Packaging: Cut Tape (CT); Part Status: Active; Technology: MOSFET (Metal Oxide); FET Feature: -; Operating Temperature: -55°C ~ 150°C (TJ); Mounting Type: Surface Mount; Supplier Device Package: SOT-23-3 (TO-236); Package / Case: TO-236-3, SC-59, SOT-23-3; ComponentLink1URL: http://www.onsemi.com/pub/Collateral/BSS138LT1-D.PDF; ComponentLink1Description: http://www.onsemi.com/pub/Collateral/BSS138LT1-D.PDF; Supplier Part Number 1: BSS138LT1GOSCT-ND
R1.3 R2.3 R3.3 R4.3 R5.3 = RC0603FR-0710KL: as R2.7 on sheet [07]-SOLENOID; Supplier 1: Digi-Key; Manufacturer Part Number: RC0603FR-0710KL; RoHS: RoHS Compliant; Category: Resistors; Stock 1: 16545228; Pricing 1: 1=0.1, 10=0.015, 100=0.006, 1000=0.00268, 2500=0.00233 (USD); Packaging: Cut Tape (CT); Part Status: Active; Composition: Thick Film; Features: Moisture Resistant; Operating Temperature: -55°C ~ 155°C; Package / Case: 0603 (1608 Metric); Supplier Device Package: 0603; Size / Dimension: 0.063" L x 0.032" W (1.60mm x 0.80mm); Height - Seated (Max): 0.022" (0.55mm); Failure Rate: -; ComponentLink1URL: http://www.yageo.com/documents/recent/PYu-RC_Group_51_RoHS_L_7.pdf; ComponentLink1Description: http://www.yageo.com/documents/recent/PYu-RC_Group_51_RoHS_L_7.pdf; Supplier Part Number 1: 311-10.0KHRCT-ND; Value: 10K
U1.3 = MPU6050: Accelerometer, Gyroscope, 6 Axis Sensor IÂ²C Output; MF: TDK InvenSense; Price: None; Package: VFQFN-24 TDK InvenSense; Value: *; MP: MPU6050; Availability: Unavailable; SnapEDA_Link: https://www.snapeda.com/parts/MPU6050/TDK%20InvenSense/view-part/3605706/?ref=snap

## Sheet [04]-CH340.SchDoc
size A4; Organization: Indruino Co., Ltd; Address1: No. 1, Vo Van Ngan Street; Address2: Thu Duc District, HCMC; SheetNumber: 5; SheetTotal: 9
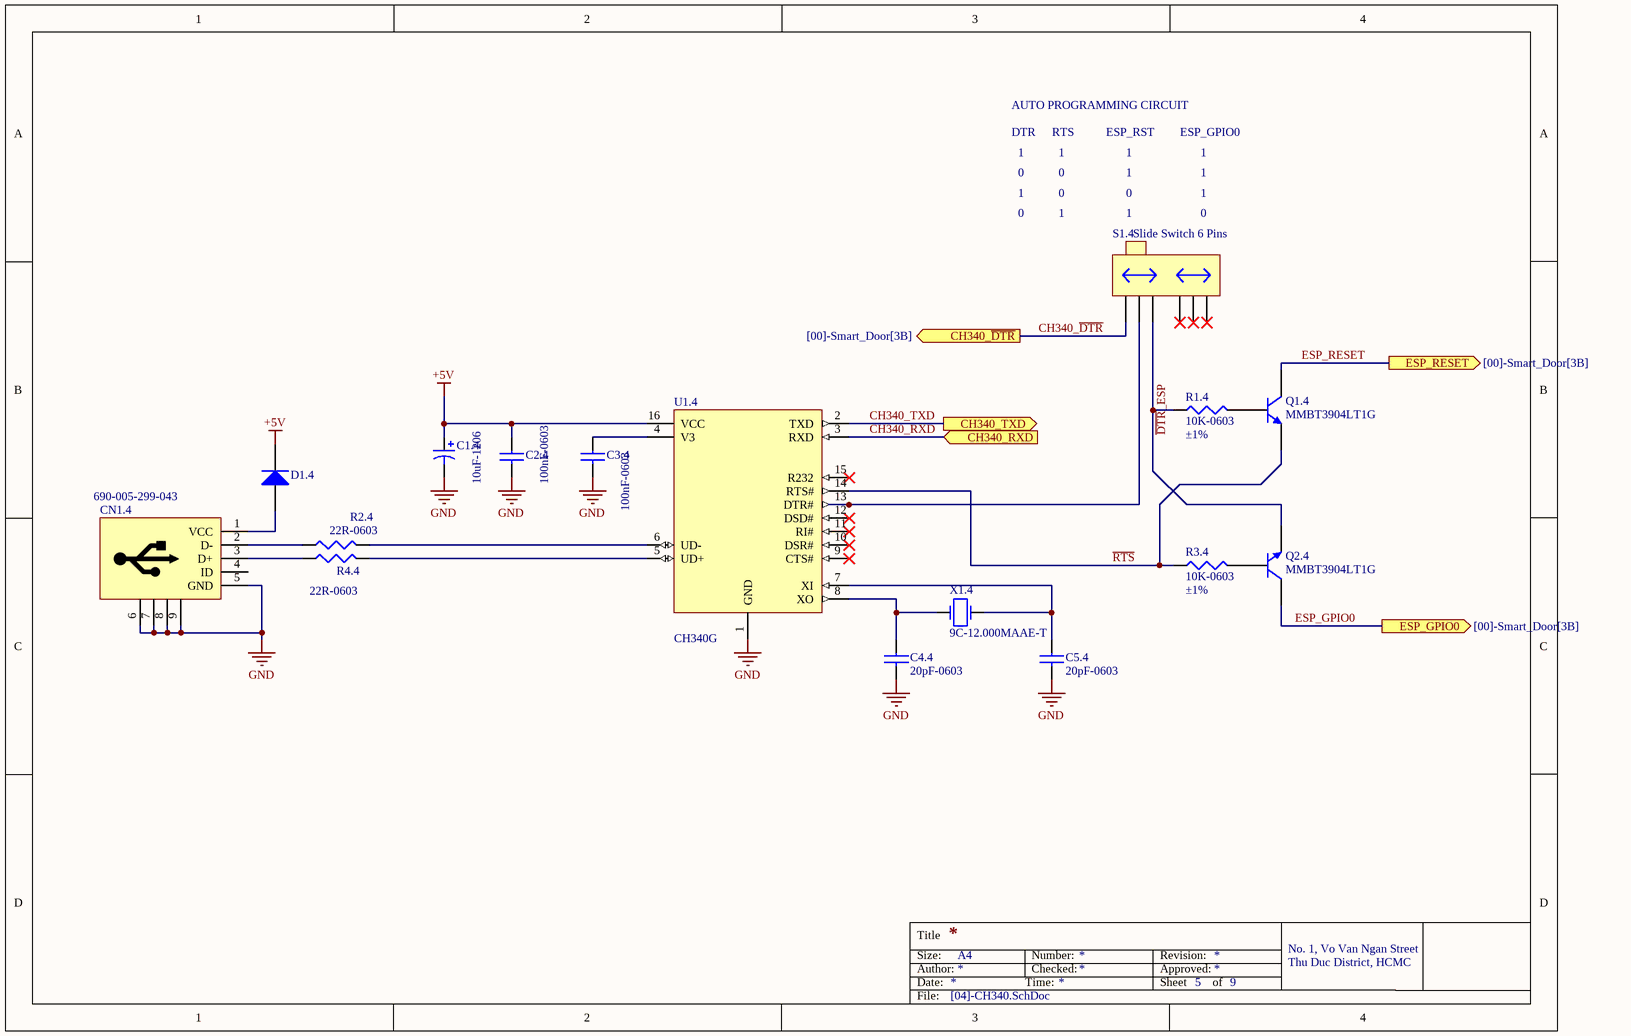
[diagram p8: [04]-CH340.SchDoc]

### Parts
C1.4  10uF-1206  [CAP1206_TANTALUM_YELLOW]
C2.4  100nF-0603  [CAP0603]
C3.4  100nF-0603  [CAP0603]
C4.4  20pF-0603  [CAP0603]
C5.4  20pF-0603  [CAP0603]
CN1.4  690-005-299-043  [USB-B-MINI_690-005-299-043]
D1.4  DIODE_S1A-13-F  [DO-214AC]  (value not drawn)
Q1.4  MMBT3904LT1G  [SOT23-3]
Q2.4  MMBT3904LT1G  [SOT23-3]
R1.4  10K-0603  Tolerance: ±1%  [RES0603]
R2.4  22R-0603  [RES0603]
R3.4  10K-0603  Tolerance: ±1%  [RES0603]
R4.4  22R-0603  [RES0603]
S1.4  Slide Switch 6 Pins  [SW6_MSS-22D18]
U1.4  CH340G  [CH340G]
X1.4  9C-12.000MAAE-T  [XTAL_SMD_HC-49S]

### Ports
CH340_RXD (in, see [00]-Smart_Door[3B]), CH340_TXD (out, see [00]-Smart_Door[3B]), CH340_~{DTR} (out, see [00]-Smart_Door[3B]), ESP_GPIO0 (out, see [00]-Smart_Door[3B]), ESP_RESET (out, see [00]-Smart_Door[3B])

### Nets
+5V: C1.4.1 C2.4.1 D1.4.2(K) U1.4.16(VCC)
GND: C1.4.2 C2.4.2 C3.4.2 C4.4.2 C5.4.2 CN1.4.5(GND) CN1.4.6 CN1.4.7 CN1.4.8 CN1.4.9 U1.4.1(GND)
CH340_~{DTR}: S1.4.1(NC) ; port CH340_~{DTR}  [project net /MCU_RESET]
CH340_RXD: U1.4.3(RXD) ; port CH340_RXD
CH340_TXD: U1.4.2(TXD) ; port CH340_TXD
~{DTR}_ESP: Q2.4.2(E) R1.4.1 S1.4.5(NO)
ESP_GPIO0: Q2.4.3(C) ; port ESP_GPIO0
ESP_RESET: Q1.4.3(C) ; port ESP_RESET  [project net /RESET_WIFI]
~{RTS}: Q1.4.2(E) R3.4.1 U1.4.14(RTS#)
NetC3.4_1: C3.4.1 U1.4.4(V3)
NetC4.4_1: C4.4.1 U1.4.8(XO) X1.4.2(OSC2)
NetC5.4_1: C5.4.1 U1.4.7(XI) X1.4.1(OSC1)
NetCN1.4_1: CN1.4.1(VCC) D1.4.1(A)
NetCN1.4_2: CN1.4.2(D-) R2.4.1
NetCN1.4_3: CN1.4.3(D+) R4.4.1
NetQ1.4_1: Q1.4.1(B) R1.4.2
NetQ2.4_1: Q2.4.1(B) R3.4.2
NetR2.4_2: R2.4.2 U1.4.6(UD-)
NetR4.4_2: R4.4.2 U1.4.5(UD+)
NetS1.4_3: S1.4.3(COM) U1.4.13(DTR#)

Not connected (* = marked no-connect by the designer): CN1.4 4(ID); S1.4 2(NC)* 4(COM)* 6(NO)*; U1.4 9(CTS#)* 10(DSR#)* 11(RI#)* 12(DSD#)* 15(R232)*

### Notes on the sheet
- AUTO PROGRAMMING CIRCUIT
- DTR
- 1
- 0
- RTS
- ESP_RST
- ESP_GPIO0
- Title
- Size:
- Date:
- Author:
- A4
- Time:
- Number:
- Checked:
- Revision:
- Sheet
- Approved:
- of
- File:

### Library data of the parts
C1.4 = T491A106K016AT: as C7.6 on sheet [06]-POWER_SUPPLY; Supplier 1: Digi-Key; Supplier Part Number 1: 399-8269-1-ND; Manufacturer Part Number 1: T491A106K016AT; RoHS 1: RoHS Compliant; Description 1: CAP TANT 10UF 16V 10% 1206; Stock 1: 54083; Pricing 1: 1=0.45, 10=0.312, 100=0.1873, 500=0.14048, 1000=0.11862 (USD); Packaging: Cut Tape (CT); Part Status: Active; Operating Temperature: -55°C ~ 125°C; Mounting Type: Surface Mount; Package / Case: 1206 (3216 Metric); Size / Dimension: 0.126" L x 0.063" W (3.20mm x 1.60mm); Height - Seated (Max): 0.071" (1.80mm); Lead Spacing: -; Features: General Purpose; Failure Rate: -; ComponentLink1URL: http://www.kemet.com/Lists/ProductCatalog/Attachments/254/KEM_T2005_T491.pdf; ComponentLink1Description: http://www.kemet.com/Lists/ProductCatalog/Attachments/254/KEM_T2005_T491.pdf; Value: 10uF; Tolerance: ±10%; Voltage - Rated: 16V
C2.4 C3.4 = CC0603KRX7R0BB104: as C2.6 on sheet [06]-POWER_SUPPLY; Supplier 1: Digi-Key; Manufacturer Part Number: CC0603KRX7R0BB104; RoHS: RoHS Compliant; Category: Capacitors; Stock 1: 784508; Pricing 1: 1=0.23, 10=0.156, 100=0.0791, 500=0.05414, 1000=0.0479 (USD); Packaging: Cut Tape (CT); Part Status: Active; Temperature Coefficient: X7R; Operating Temperature: -55°C ~ 125°C; Features: -; Ratings: -; Applications: General Purpose; Failure Rate: -; Mounting Type: Surface Mount, MLCC; Package / Case: 0603 (1608 Metric); Size / Dimension: 0.063" L x 0.032" W (1.60mm x 0.80mm); Height - Seated (Max): -; Thickness (Max): 0.035" (0.90mm); Lead Spacing: -; Lead Style: -; ComponentLink1URL: http://media.digikey.com/pdf/Data%20Sheets/Yageo%20PDFs/NPO,%20X7R%20Mid-voltage.pdf; ComponentLink1Description: http://media.digikey.com/pdf/Data%20Sheets/Yageo%20PDFs/NPO,%20X7R%20Mid-voltage.pdf; Supplier Part Number 1: 311-1523-1-ND; Voltage - Rated: 100V
C4.4 C5.4 = CC0603JRNPO9BN200: CAP CER 20PF 50V C0G/NPO 0603; Manufacturer 1: Yageo; Category 1: Capacitors; Tolerance: ±5%; Temperature Coefficient: C0G, NP0; Supplier 1: Digi-Key; Supplier Part Number 1: 311-1424-1-ND; Manufacturer Part Number 1: CC0603JRNPO9BN200; RoHS 1: RoHS Compliant; Description 1: CAP CER 20PF 50V C0G/NPO 0603; Stock 1: 67895; Pricing 1: 1=0.1, 10=0.037, 100=0.0164, 500=0.01172, 1000=0.0092 (USD); Packaging: Cut Tape (CT); Part Status: Active; Capacitance: 20pF; Voltage - Rated: 50V; Operating Temperature: -55°C ~ 125°C; Features: -; Ratings: -; Applications: General Purpose; Failure Rate: -; Mounting Type: Surface Mount, MLCC; Package / Case: 0603 (1608 Metric); Size / Dimension: 0.063" L x 0.031" W (1.60mm x 0.80mm); Height - Seated (Max): -; Thickness (Max): 0.035" (0.90mm); Lead Spacing: -; Lead Style: -; ComponentLink1URL: http://www.yageo.com/documents/recent/UPY-GP_NP0_16V-to-50V_16.pdf; ComponentLink1Description: http://www.yageo.com/documents/recent/UPY-GP_NP0_16V-to-50V_16.pdf; Value: 20pF
CN1.4 = USB_690-005-299-043: CONN MINI USB RCPT RA TYPE B SMD; Manufacturer: EDAC Inc.; Connector Type: USB - mini B; Number of Contacts: 5; Gender: Receptacle; Specifications: USB 2.0; Current Rating: 1A; Mating Cycles: 1500; Shielding: Unshielded; Material Flammability Rating: UL94 V-0; Supplier 1: Digi-Key; Manufacturer Part Number: 690-005-299-043; RoHS: RoHS Compliant; Category: Connectors, Interconnects; Stock 1: 72905; Pricing 1: 1=0.54, 10=0.51, 25=0.4592, 50=0.408, 100=0.391, 250=0.357, 500=0.34 (USD); Packaging: Cut Tape (CT); Part Status: Active; Mounting Type: Surface Mount, Right Angle; Mounting Feature: Horizontal; Termination: Solder; Features: Board Guide, Solder Retention; Ingress Protection: -; Operating Temperature: -30°C ~ 80°C; Voltage - Rated: -; Contact Finish: Gold; Shell/Shielding Material: Brass; Insulation Color: Black; ComponentLink1URL: http://files.edac.net/690-005-299-043.pdf; ComponentLink1Description: http://files.edac.net/690-005-299-043.pdf; Supplier Part Number 1: 151-1206-1-ND
D1.4 = DIODE_S1A-13-F: as D1.6 on sheet [06]-POWER_SUPPLY; Supplier 1: Digi-Key; Manufacturer Part Number: S1A-13-F; RoHS: RoHS Compliant; Category: Discrete Semiconductor Products; Stock 1: 293435; Pricing 1: 1=0.27, 10=0.219, 100=0.1163, 500=0.07652, 1000=0.05203 (USD); Packaging: Digi-Reel®; Part Status: Active; Current - Average Rectified (Io): 1A; Mounting Type: Surface Mount; Package / Case: DO-214AC, SMA; Supplier Device Package: SMA; Operating Temperature - Junction: -65°C ~ 150°C; Base Part Number: S1A; ComponentLink1URL: https://www.diodes.com/assets/Datasheets/ds16003.pdf; ComponentLink1Description: https://www.diodes.com/assets/Datasheets/ds16003.pdf; Supplier Part Number 1: S1A-FDIDKR-ND
Q1.4 Q2.4 = MMBT3904LT1G: TRANS NPN 40V 0.2A SOT23; Manufacturer 1: ON Semiconductor; Category 1: Discrete Semiconductor Products; Current - Collector (Ic) (Max): 200mA; Vce Saturation (Max) @ Ib, Ic: 300mV @ 5mA, 50mA; DC Current Gain (hFE) (Min) @ Ic, Vce: 100 @ 10mA, 1V; Power - Max: 300mW; Frequency - Transition: 300MHz; Supplier 1: Digi-Key; Supplier Part Number 1: MMBT3904LT1GOSCT-ND; Manufacturer Part Number 1: MMBT3904LT1G; RoHS 1: RoHS Compliant; Description 1: TRANS NPN 40V 0.2A SOT23; Stock 1: 366071; Pricing 1: 1=0.11, 10=0.103, 100=0.0562, 500=0.03456, 1000=0.02356 (USD); Packaging: Cut Tape (CT); Part Status: Active; Transistor Type: NPN; Voltage - Collector Emitter Breakdown (Max): 40V; Current - Collector Cutoff (Max): -; Operating Temperature: -55°C ~ 150°C (TJ); Mounting Type: Surface Mount; Package / Case: TO-236-3, SC-59, SOT-23-3; Supplier Device Package: SOT-23-3 (TO-236); ComponentLink1URL: http://www.onsemi.com/pub_link/Collateral/MMBT3904LT1-D.PDF; ComponentLink1Description: http://www.onsemi.com/pub_link/Collateral/MMBT3904LT1-D.PDF
R1.4 R3.4 = RC0603FR-0710KL: as R2.7 on sheet [07]-SOLENOID; Supplier 1: Digi-Key; Manufacturer Part Number: RC0603FR-0710KL; RoHS: RoHS Compliant; Category: Resistors; Stock 1: 16545228; Pricing 1: 1=0.1, 10=0.015, 100=0.006, 1000=0.00268, 2500=0.00233 (USD); Packaging: Cut Tape (CT); Part Status: Active; Composition: Thick Film; Features: Moisture Resistant; Operating Temperature: -55°C ~ 155°C; Package / Case: 0603 (1608 Metric); Supplier Device Package: 0603; Size / Dimension: 0.063" L x 0.032" W (1.60mm x 0.80mm); Height - Seated (Max): 0.022" (0.55mm); Failure Rate: -; ComponentLink1URL: http://www.yageo.com/documents/recent/PYu-RC_Group_51_RoHS_L_7.pdf; ComponentLink1Description: http://www.yageo.com/documents/recent/PYu-RC_Group_51_RoHS_L_7.pdf; Supplier Part Number 1: 311-10.0KHRCT-ND; Value: 10K
R2.4 R4.4 = RC0603JR-0722RL: as R1.6 on sheet [06]-POWER_SUPPLY; Supplier 1: Digi-Key; Supplier Part Number 1: 311-22GRCT-ND; Manufacturer Part Number 1: RC0603JR-0722RL; RoHS 1: RoHS Compliant; Description 1: RES SMD 22 OHM 5% 1/10W 0603; Stock 1: 344316; Pricing 1: 1=0.1, 10=0.011, 100=0.0044, 1000=0.00198, 2500=0.00172 (USD); Packaging: Cut Tape (CT); Part Status: Active; Composition: Thick Film; Features: Moisture Resistant; Operating Temperature: -55°C ~ 155°C; Package / Case: 0603 (1608 Metric); Size / Dimension: 0.063" L x 0.031" W (1.60mm x 0.80mm); Height - Seated (Max): 0.022" (0.55mm); Failure Rate: -; ComponentLink1URL: http://www.yageo.com/documents/recent/PYu-RC_Group_51_RoHS_L_7.pdf; ComponentLink1Description: http://www.yageo.com/documents/recent/PYu-RC_Group_51_RoHS_L_7.pdf; Tolerance: ±5%; Supplier Device Package: 0603
S1.4 = Slide Switch 6 Pins: Switch; Published: 24-Mar-1999; LatestRevisionDate: 17-Jul-2002; LatestRevisionNote: Re-released for DXP Platform.; PackageReference: SPST-2; Publisher: Altium Limited
U1.4 = CH340G: USB to serial chip CH340
X1.4 = XTAL_9C-12.000MAAE-T: CRYSTAL 12.0000MHZ 12PF SMD; Manufacturer: TXC CORPORATION; Frequency Stability: ±30ppm; Operating Mode: Fundamental; Supplier 1: Digi-Key; Manufacturer Part Number: 9C-12.000MAAE-T; RoHS: RoHS Compliant; Category: Crystals, Oscillators, Resonators; Stock 1: 0; Pricing 1: 1000=0.208 (USD); Packaging: Tape & Reel (TR); Part Status: Active; Type: MHz Crystal; Frequency Tolerance: ±30ppm; Load Capacitance: 12pF; Operating Temperature: -20°C ~ 70°C; Ratings: -; Mounting Type: Surface Mount; Package / Case: HC-49S; Size / Dimension: 0.449" L x 0.189" W (11.40mm x 4.80mm); Height - Seated (Max): 0.161" (4.10mm); ComponentLink1URL: http://www.txccorp.com/download/products/quartz_crystals/2015TXC_9C_32.pdf; ComponentLink1Description: http://www.txccorp.com/download/products/quartz_crystals/2015TXC_9C_32.pdf; Supplier Part Number 1: 9C-12.000MAAE-T-ND

## Nets that join several sheets
+3V3: [01]-ATMEGA328 (C4.1.1 M1.1.8), [02]-ESP8266 (8 pins), [06]-POWER_SUPPLY (5 pins), [03]-MPU6050 (8 pins)
+5V: [01]-ATMEGA328 (10 pins), [05]-SW420 (6 pins), [06]-POWER_SUPPLY (6 pins), [03]-MPU6050 (R1.3.2 R4.3.2), [04]-CH340 (C1.4.1 C2.4.1 D1.4.2 U1.4.16)
+12V: [07]-SOLENOID (D1.7.2 K1.7.4 P1.7.1), [08]-ALARM (D1.8.2 P1.8.1)
GND: [01]-ATMEGA328 (26 pins), [02]-ESP8266 (5 pins), [05]-SW420 (5 pins), [06]-POWER_SUPPLY (17 pins), [07]-SOLENOID (K1.7.3 Q1.7.2 R2.7.1), [08]-ALARM (Q1.8.2 R2.8.1), [03]-MPU6050 (6 pins), [04]-CH340 (11 pins)
/MCU_RESET: [01]-ATMEGA328 (5 pins), [04]-CH340 (S1.4.1)
/RESET_WIFI: [02]-ESP8266 (C1.2.1 R4.2.1 U1.2.1), [04]-CH340 (Q1.4.3)
ALARM: [01]-ATMEGA328 (U1.1.12), [08]-ALARM (R1.8.1)
CH340_RXD: [00]-Smart_Door (S1.0.4), [04]-CH340 (U1.4.3)
CH340_TXD: [00]-Smart_Door (S1.0.3), [04]-CH340 (U1.4.2)
ESP_GPIO0: [02]-ESP8266 (R1.2.1 U1.2.12), [04]-CH340 (Q2.4.3)
MCU_RXD: [00]-Smart_Door (S1.0.1), [01]-ATMEGA328 (U1.1.30)
MCU_TXD: [00]-Smart_Door (S1.0.2), [01]-ATMEGA328 (U1.1.31)
MPU6050_INT: [01]-ATMEGA328 (U1.1.26), [03]-MPU6050 (R5.3.1 U1.3.12)
NetS1.0_5: [00]-Smart_Door (S1.0.5 S2.0.3), [02]-ESP8266 (U1.2.15)
NetS1.0_6: [00]-Smart_Door (S1.0.6 S2.0.4), [02]-ESP8266 (U1.2.16)
SCL: [01]-ATMEGA328 (U1.1.28), [03]-MPU6050 (Q2.3.3 R4.3.1)
SDA: [01]-ATMEGA328 (U1.1.27), [03]-MPU6050 (Q1.3.3 R1.3.1)
SOFT_RXD: [00]-Smart_Door (S2.0.6), [01]-ATMEGA328 (U1.1.24)
SOFT_TXD: [00]-Smart_Door (S2.0.5), [01]-ATMEGA328 (U1.1.25)
SOLENOID: [01]-ATMEGA328 (U1.1.11), [07]-SOLENOID (R1.7.1)
VIB_IN: [01]-ATMEGA328 (U1.1.23), [05]-SW420 (R1.5.1 R3.5.1 U1.5.1)